# Altium schematic sheet CE842170047_SHEET6.SchDoc
size Tabloid; SheetNumber: 5; SheetTotal: 5; PageSetup: Record=PageOptions|CenterHorizontal=True|CenterVertical=True|PrintScale=0.70|XCorrection=1.00|YCorrection=1.00|PrintKind=1|BorderSize=5000000|LeftOffset=0|BottomOffset=0|Orientation=2|PaperLength=1000|PaperWidth=1000|Scale=100|PaperSource=7|PrintQuality=-4|MediaType=1|DitherType=10|PaperKind=8 1/2x11|PrintScaleMode=1; SPICEModelCacheMIYJXAQF: <root> / <DocumentId>MIYJXAQF</DocumentId> / </root>
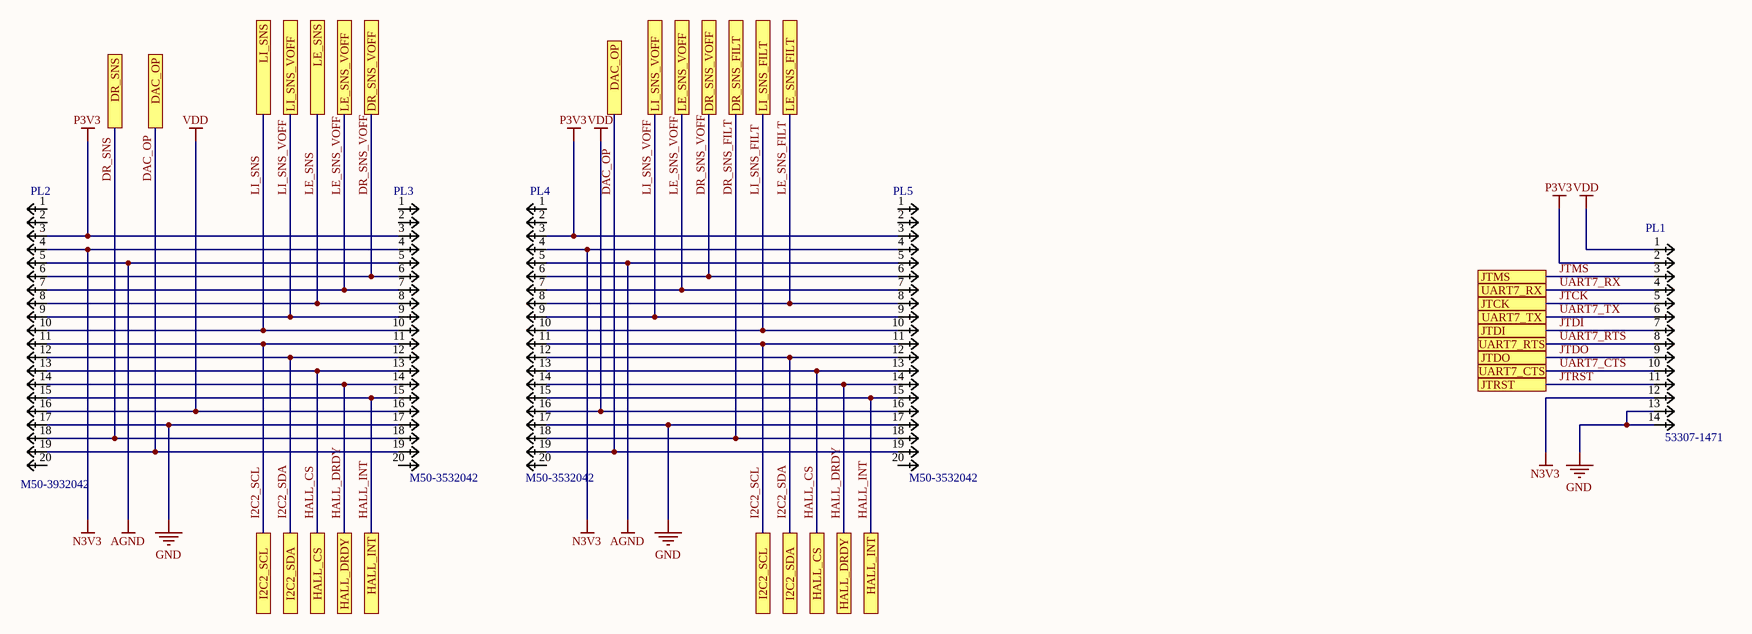
[diagram p0: CE842170047_SHEET6.SchDoc]

## Parts
PL1  KK/96510/1748  [53307-1471]  (value not drawn)
PL2  KK/96510/2206  [M50-3932042]  (value not drawn)
PL3  KK/96510/2208  [M50-3532042]  (value not drawn)
PL4  KK/96510/2208  [M50-3532042]  (value not drawn)
PL5  KK/96510/2208  [M50-3532042]  (value not drawn)

## Ports
DAC_OP, DR_SNS, DR_SNS_FILT, DR_SNS_VOFF, HALL_CS, HALL_DRDY, HALL_INT, I2C2_SCL, I2C2_SDA, JTCK, JTDI, JTDO, JTMS, JTRST, LE_SNS, LE_SNS_FILT, LE_SNS_VOFF, LI_SNS, LI_SNS_FILT, LI_SNS_VOFF, UART7_CTS, UART7_RTS, UART7_RX, UART7_TX

## Nets
AGND: PL2.5 PL3.5 PL4.5 PL5.5
GND: PL1.13 PL1.14 PL2.17 PL3.17 PL4.17 PL5.17
N3V3: PL1.12 PL2.4 PL3.4 PL4.4 PL5.4
P3V3: PL1.2 PL2.3 PL3.3 PL4.3 PL5.3
VDD: PL1.1 PL2.16 PL3.16 PL4.16 PL5.16
DAC_OP: PL2.19 PL3.19 PL4.19 PL5.19 ; port DAC_OP
DR_SNS: PL2.18 PL3.18 ; port DR_SNS
DR_SNS_FILT: PL4.18 PL5.18 ; port DR_SNS_FILT
DR_SNS_VOFF: PL2.6 PL3.6 PL4.6 PL5.6 ; port DR_SNS_VOFF
HALL_CS: PL2.13 PL3.13 PL4.13 PL5.13 ; port HALL_CS
HALL_DRDY: PL2.14 PL3.14 PL4.14 PL5.14 ; port HALL_DRDY
HALL_INT: PL2.15 PL3.15 PL4.15 PL5.15 ; port HALL_INT
I2C2_SCL: PL2.11 PL3.11 PL4.11 PL5.11 ; port I2C2_SCL
I2C2_SDA: PL2.12 PL3.12 PL4.12 PL5.12 ; port I2C2_SDA
JTCK: PL1.5 ; port JTCK
JTDI: PL1.7 ; port JTDI
JTDO: PL1.9 ; port JTDO
JTMS: PL1.3 ; port JTMS
JTRST: PL1.11 ; port JTRST
LE_SNS: PL2.8 PL3.8 ; port LE_SNS
LE_SNS_FILT: PL4.8 PL5.8 ; port LE_SNS_FILT
LE_SNS_VOFF: PL2.7 PL3.7 PL4.7 PL5.7 ; port LE_SNS_VOFF
LI_SNS: PL2.10 PL3.10 ; port LI_SNS
LI_SNS_FILT: PL4.10 PL5.10 ; port LI_SNS_FILT
LI_SNS_VOFF: PL2.9 PL3.9 PL4.9 PL5.9 ; port LI_SNS_VOFF
UART7_CTS: PL1.10 ; port UART7_CTS
UART7_RTS: PL1.8 ; port UART7_RTS
UART7_RX: PL1.4 ; port UART7_RX
UART7_TX: PL1.6 ; port UART7_TX

Not connected (* = marked no-connect by the designer): PL2 1 2 20; PL3 1 2 20; PL4 1 2 20; PL5 1 2 20

## Notes on the sheet
- BH CONFIDENTIAL
- NOTE
- Title:
- Sheet Title:
- Designed:
- Checked:
- Date:
- DRAWN IN ACCORDANCE WITH TECHNOLOGY WORK INSTRUCTIONS W064
- REV
- DATE
- ECR/ECN
- INT'L
- Number:
- Approved:
- FOR LIMITED NEED TO KNOW USE ONLY. NO PARTS OF THIS DOCUMENT MAY BE PRODUCED OR DISCLOSED WITHOUT PRIOR PERMISSION OF BH
- File:
- Sheet:
- of

## Library data of the parts
PL1 = KK/96510/1748: PLUG HEADER 2x7WAY STRAIGHT MOLEX; ID: 883; MF_PartNumber: 53307-1471; PII_PartNumber: KK/96510/1748; Pins: 14; Manufacturer: MOLEX
PL2 = KK/96510/2206: PLUG 20WAY RIGHT ANGLE PTH HARWIN; ID: 882; MF_PartNumber: M50-3932042; PII_PartNumber: KK/96510/2206; Pins: 5; Manufacturer: HARWIN
PL3-PL5 = KK/96510/2208: PLUG,20WAY,STRAIGHT,PITCH 1.27MM,HWN,M50-3532042; Manufacturer: HARWIN; ID: 885; MF_PartNumber: M50-3532042; PII_PartNumber: KK/96510/2208; Pins: 20